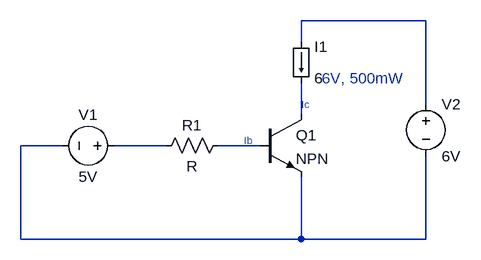
[diagram p0: schematic electronics_calc_npn_resistor_values_based_on_power.asc]
electronics_calc_npn_resistor_values_based_on_power.asc, the LTspice schematic file:
Version 4
SHEET 1 880 680
WIRE 432 -64 240 -64
WIRE 240 -32 240 -64
WIRE 432 64 432 -64
WIRE 240 80 240 32
WIRE -128 128 -192 128
WIRE 32 128 -48 128
WIRE 176 128 112 128
WIRE 432 272 432 144
WIRE -192 272 -192 128
WIRE 240 272 240 176
WIRE 240 272 -192 272
WIRE 432 272 240 272
SYMBOL res 128 112 R90
WINDOW 0 0 56 VBottom 2
WINDOW 3 32 56 VTop 2
SYMATTR InstName R1
SYMBOL npn 176 80 R0
SYMATTR InstName Q1
SYMBOL load 224 -32 R0
WINDOW 123 0 0 Left 0
WINDOW 39 0 0 Left 0
SYMATTR InstName I1
SYMATTR Value 6
SYMBOL voltage -32 128 R90
WINDOW 0 -32 56 VBottom 2
WINDOW 3 32 56 VTop 2
WINDOW 123 0 0 Left 0
WINDOW 39 0 0 Left 0
SYMATTR InstName V1
SYMATTR Value 5V
SYMBOL voltage 432 48 R0
WINDOW 123 0 0 Left 0
WINDOW 39 0 0 Left 0
SYMATTR InstName V2
SYMATTR Value 6V
TEXT 272 24 Left 2 ;6V, 500mW
TEXT 152 120 Left 1 ;Ib
TEXT 240 64 Left 1 ;Ic

The netlist it stands for:
* electronics_calc_npn_resistor_values_based_on_power.asc
R1 N005 N004 R
Q1 N002 N005 N003 0 NPN
I1 N001 N002 6
V1 N004 N003 5V
V2 N001 N003 6V
.model NPN NPN
.model PNP PNP
.lib standard.bjt
* 6V, 500mW
* Ib
* Ic
.backanno
.end